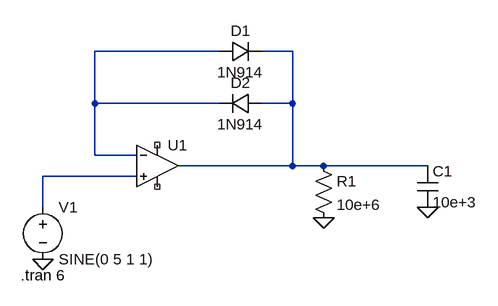
[diagram p0: schematic Draft2.asc]
Draft2.asc, the LTspice schematic file:
Version 4
SHEET 1 880 680
WIRE 48 -48 -144 -48
WIRE 160 -48 112 -48
WIRE -144 32 -144 -48
WIRE 48 32 -144 32
WIRE 160 32 160 -48
WIRE 160 32 112 32
WIRE -144 112 -144 32
WIRE -80 112 -144 112
WIRE 160 128 160 32
WIRE 160 128 -16 128
WIRE 208 128 160 128
WIRE 368 128 208 128
WIRE -80 144 -224 144
WIRE -224 192 -224 144
FLAG 208 208 0
FLAG 368 192 0
FLAG -224 272 0
SYMBOL OpAmps\\UniversalOpAmp -48 128 R0
SYMATTR InstName U1
SYMBOL voltage -224 176 R0
WINDOW 123 0 0 Left 0
WINDOW 39 0 0 Left 0
SYMATTR InstName V1
SYMATTR Value SINE(0 5 1 1)
SYMBOL res 192 112 R0
SYMATTR InstName R1
SYMATTR Value 10e+6
SYMBOL cap 352 128 R0
SYMATTR InstName C1
SYMATTR Value 10e+3
SYMBOL diode 48 -32 R270
WINDOW 0 32 32 VTop 2
WINDOW 3 0 32 VBottom 2
SYMATTR InstName D1
SYMATTR Value 1N914
SYMBOL diode 112 16 R90
WINDOW 0 0 32 VBottom 2
WINDOW 3 32 32 VTop 2
SYMATTR InstName D2
SYMATTR Value 1N914
TEXT -258 296 Left 2 !.tran 6

The netlist it stands for:
* Draft2.asc
XU1 N003 N001 NC_01 NC_02 N002 level1 Avol=1Meg GBW=10Meg Vos=0 En=0 Enk=0 In=0 Ink=0 Rin=500Meg  ; pins In+ In- V+ V- OUT
V1 N003 0 SINE(0 5 1 1)
R1 N002 0 10e+6
C1 N002 0 10e+3
D1 N001 N002 1N914
D2 N002 N001 1N914
.model D D
.lib standard.dio
.tran 6
.lib UniversalOpAmp1.lib
.backanno
.end